# Altium schematic sheet MANEA_TCAD_PROIECT_Sheet2.SchDoc (part 1 of 3)
size A4; SheetNumber: 1; SheetTotal: 1
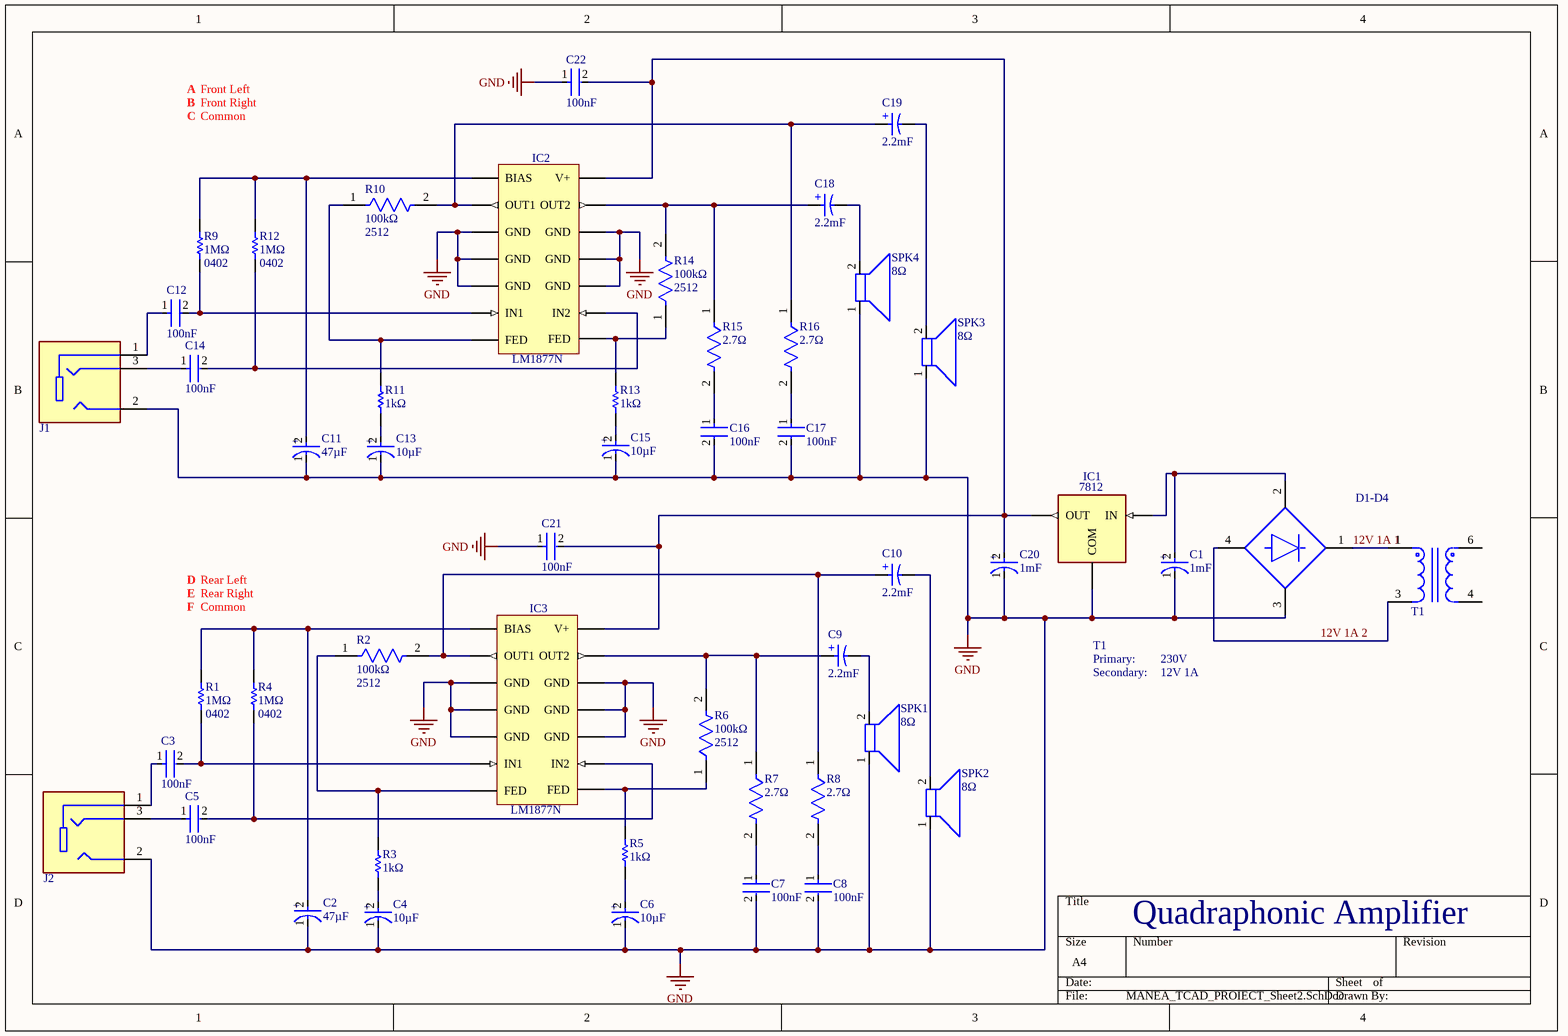
[diagram p0: MANEA_TCAD_PROIECT_Sheet2.SchDoc]

## Parts
C1  value 1mF  [FP-FK-J16-MFG]  (hidden comment: EEV-FK1H102M)
C2  value 47µF  [FP-EDH476M050S9HAA-IPC_A]  (hidden comment: EDH476M050S9HAA)
C3  value 100nF  [FP-CC0603-DA-MFG]  (hidden comment: Cap 100nF)
C4  value 10µF  [FP-FPB-MFG]  (hidden comment: EEEFP1C100AR)
C5  value 100nF  [FP-CC0603-DA-MFG]  (hidden comment: Cap 100nF)
C6  value 10µF  [FP-FPB-MFG]  (hidden comment: EEEFP1C100AR)
C7  value 100nF  [FP-CC0603-DA-MFG]  (hidden comment: Cap 100nF)
C8  value 100nF  [FP-CC0603-DA-MFG]  (hidden comment: Cap 100nF)
C9  value 2.2mF  [WCAP-ASLI_D16H17]  (hidden comment: 865080463017)
C10  value 2.2mF  [WCAP-ASLI_D16H17]  (hidden comment: 865080463017)
C11  value 47µF  [FP-EDH476M050S9HAA-IPC_A]  (hidden comment: EDH476M050S9HAA)
C12  value 100nF  [FP-CC0603-DA-MFG]  (hidden comment: Cap 100nF)
C13  value 10µF  [FP-FPB-MFG]  (hidden comment: EEEFP1C100AR)
C14  value 100nF  [FP-CC0603-DA-MFG]  (hidden comment: Cap 100nF)
C15  value 10µF  [FP-FPB-MFG]  (hidden comment: EEEFP1C100AR)
C16  value 100nF  [FP-CC0603-DA-MFG]  (hidden comment: Cap 100nF)
C17  value 100nF  [FP-CC0603-DA-MFG]  (hidden comment: Cap 100nF)
C18  value 2.2mF  [WCAP-ASLI_D16H17]  (hidden comment: 865080463017)
C19  value 2.2mF  [WCAP-ASLI_D16H17]  (hidden comment: 865080463017)
C20  value 1mF  [FP-FK-J16-MFG]  (hidden comment: EEV-FK1H102M)
C21  value 100nF  [FP-CC0603-DA-MFG]  (hidden comment: Cap 100nF)
C22  value 100nF  [FP-CC0603-DA-MFG]  (hidden comment: Cap 100nF)
D1-D4  VS-36MB160A  [FP-95326-MFG]  (value not drawn)
IC1  LM7812  [TO254P1054X470X1955-3]  (value not drawn)
IC2  LM1877N  [DIP254P762X533-14]  (value not drawn)
IC3  LM1877N  [DIP254P762X533-14]  (value not drawn)
J1  SJ1-3523N  [CUI_SJ1-3523N]  (value not drawn)
J2  SJ1-3523N  [CUI_SJ1-3523N]  (value not drawn)
R1  value 1MΩ  Case/Package: 0402  [RESC1005X40X25NL05T10]  (hidden comment: RC0402FR-071ML)
R2  value 100kΩ  Case/Package: 2512  [FP-CRGP2512-IPC_A]  (hidden comment: CRGP2512F100K)
R3  value 1kΩ  [RESC3116X65X40NL10T20]  (hidden comment: RC1206FR-071KL)
R4  value 1MΩ  Case/Package: 0402  [RESC1005X40X25NL05T10]  (hidden comment: RC0402FR-071ML)
R5  value 1kΩ  [RESC3116X65X40NL10T20]  (hidden comment: RC1206FR-071KL)
R6  value 100kΩ  Case/Package: 2512  [FP-CRGP2512-IPC_A]  (hidden comment: CRGP2512F100K)
R7  value 2.7Ω  [FP-CR0402-MFG]  (hidden comment: CR0402-J/-2R7GLF)
R8  value 2.7Ω  [FP-CR0402-MFG]  (hidden comment: CR0402-J/-2R7GLF)
R9  value 1MΩ  Case/Package: 0402  [RESC1005X40X25NL05T10]  (hidden comment: RC0402FR-071ML)
R10  value 100kΩ  Case/Package: 2512  [FP-CRGP2512-IPC_A]  (hidden comment: CRGP2512F100K)
R11  value 1kΩ  [RESC3116X65X40NL10T20]  (hidden comment: RC1206FR-071KL)
R12  value 1MΩ  Case/Package: 0402  [RESC1005X40X25NL05T10]  (hidden comment: RC0402FR-071ML)
R13  value 1kΩ  [RESC3116X65X40NL10T20]  (hidden comment: RC1206FR-071KL)
R14  value 100kΩ  Case/Package: 2512  [FP-CRGP2512-IPC_A]  (hidden comment: CRGP2512F100K)
R15  value 2.7Ω  [FP-CR0402-MFG]  (hidden comment: CR0402-J/-2R7GLF)
R16  value 2.7Ω  [FP-CR0402-MFG]  (hidden comment: CR0402-J/-2R7GLF)
SPK1  Impedance: 8Ω  [Manea_Speaker]  (hidden comment: ASE02808MR-LW150-R)
SPK2  Impedance: 8Ω  [Manea_Speaker]  (hidden comment: ASE02808MR-LW150-R)
SPK3  Impedance: 8Ω  [Manea_Speaker]  (hidden comment: ASE02808MR-LW150-R)
SPK4  Impedance: 8Ω  [Manea_Speaker]  (hidden comment: ASE02808MR-LW150-R)
T1  PE-68386NL  [FP-PE-68386NL-MFG]  (value not drawn)

## Nets
GND: C1.1(C) C2.1(C) C4.1(C) C6.1(C) C7.2 C8.2 C11.1(C) C13.1(C) C15.1(C) C16.2 C17.2 C20.1(C) C21.1 C22.1 D1-D4.3(2_~) IC1.2(COM) IC2.3(GND) IC2.4(GND) IC2.5(GND) IC2.10(GND) IC2.11(GND) IC2.12(GND) IC3.3(GND) IC3.4(GND) IC3.5(GND) IC3.10(GND) IC3.11(GND) IC3.12(GND) J1.2 J2.2 SPK1.1 SPK2.1 SPK3.1 SPK4.1
12V 1A 1: D1-D4.1(-) T1.1
12V 1A 2: D1-D4.4(+) T1.3
NetC1_2: C1.2(A) D1-D4.2(1_~) IC1.1(IN)
NetC2_2: C2.2(A) IC3.1(BIAS) R1.2 R4.2
NetC3_1: C3.1 J2.1
NetC3_2: C3.2 IC3.6(IN1) R1.1
NetC4_2: C4.2(A) R3.1
NetC5_1: C5.1 J2.3
NetC5_2: C5.2 IC3.9(IN2) R4.1
NetC6_2: C6.2(A) R5.1
NetC7_1: C7.1 R7.2
NetC8_1: C8.1 R8.2
NetC9_1: C9.1(P) IC3.13(OUT2) R6.2 R7.1
NetC9_2: C9.2(N) SPK1.2
NetC10_1: C10.1(P) IC3.2(OUT1) R2.2 R8.1
NetC10_2: C10.2(N) SPK2.2
NetC11_2: C11.2(A) IC2.1(BIAS) R9.2 R12.2
NetC12_1: C12.1 J1.1
NetC12_2: C12.2 IC2.6(IN1) R9.1
NetC13_2: C13.2(A) R11.1
NetC14_1: C14.1 J1.3
NetC14_2: C14.2 IC2.9(IN2) R12.1
NetC15_2: C15.2(A) R13.1
NetC16_1: C16.1 R15.2
NetC17_1: C17.1 R16.2
NetC18_1: C18.1(P) IC2.13(OUT2) R14.2 R15.1
NetC18_2: C18.2(N) SPK4.2
NetC19_1: C19.1(P) IC2.2(OUT1) R10.2 R16.1
NetC19_2: C19.2(N) SPK3.2
NetC20_2: C20.2(A) C21.2 C22.2 IC1.3(OUT) IC2.14(V+) IC3.14(V+)
NetIC2_7: IC2.7(FED) R10.1 R11.2
NetIC2_8: IC2.8(FED) R13.2 R14.1
NetIC3_7: IC3.7(FED) R2.1 R3.2
NetIC3_8: IC3.8(FED) R5.2 R6.1

Not connected (* = marked no-connect by the designer): T1 4 6

## Notes on the sheet
- A
- B
- Front Left
- Front Right
- C
- Common
- D
- Rear Left
- E
- F
- Rear Right
- T1
- Primary:
- Secondary:
- 230V
- 12V 1A
- Quadraphonic Amplifier
- (in symbol 865080463017) +
- (in symbol EDH476M050S9HAA) +
- (in symbol EEEFP1C100AR) +
- (in symbol EEV-FK1H102M) +
- (in symbol LM7812) 7812